# EAGLE design PulseGenerator (EAGLE 9.6.2)
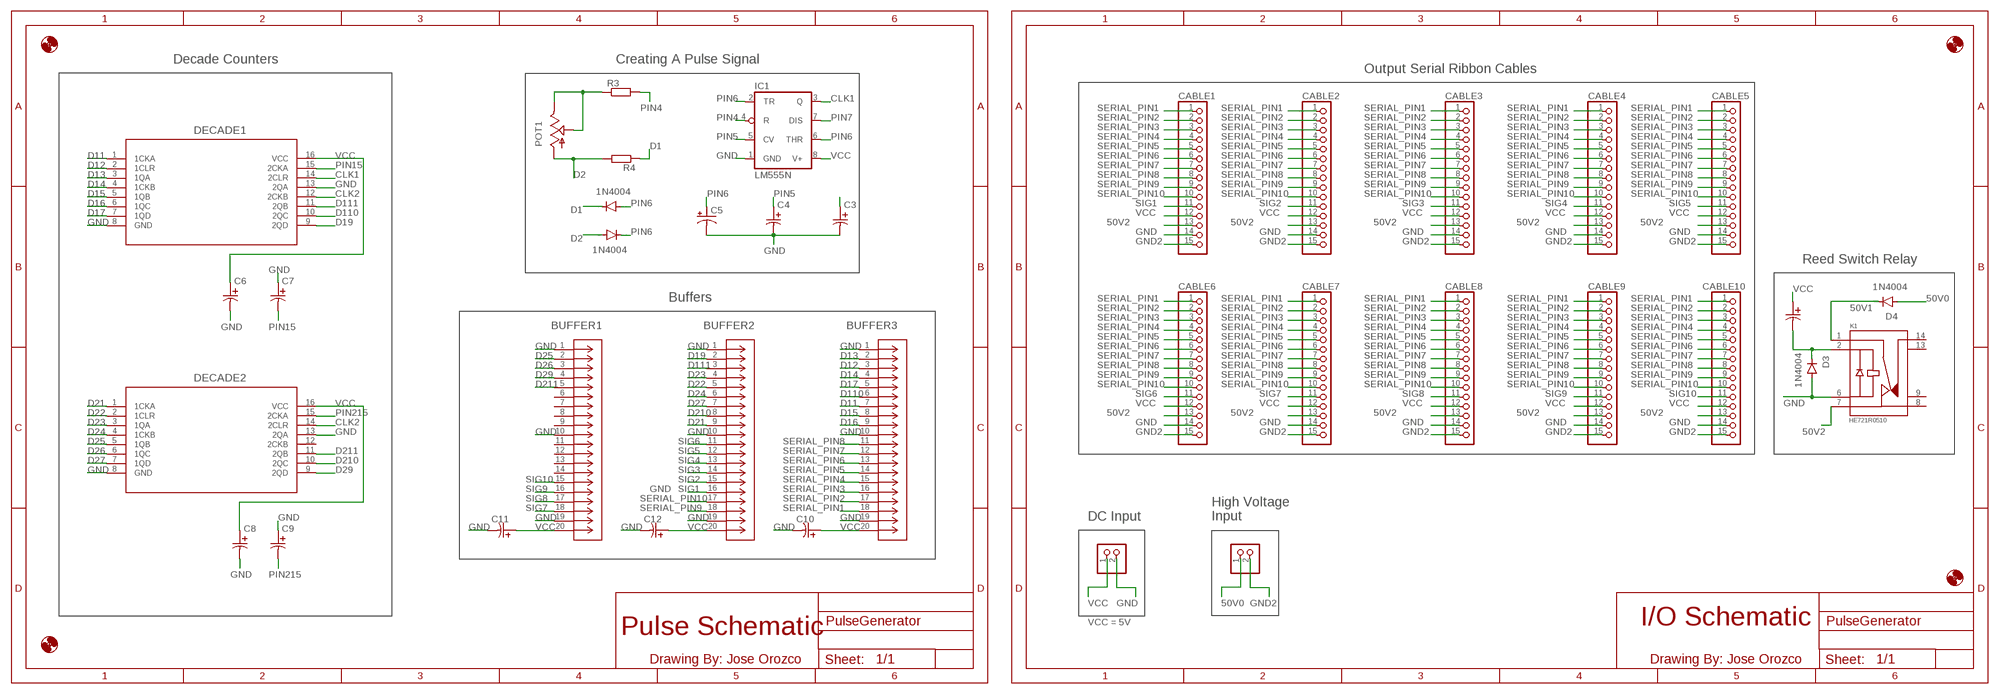
[diagram p0: schematic, sheet 1]

## Parts
BUFFER1  4820-3000-CP  [CONN_3000_3MM]
BUFFER2  4820-3000-CP  [CONN_3000_3MM]
BUFFER3  4820-3000-CP  [CONN_3000_3MM]
C1  C322C104K5R5TA  [CAP_C322_KEM]
C3  C322C104K5R5TA  [CAP_C322_KEM]
C4  C322C104K5R5TA  [CAP_C322_KEM]
C5  CPOL-USTAP5-45  [TAP5-45]
C6  C322C104K5R5TA  [CAP_C322_KEM]
C7  C322C104K5R5TA  [CAP_C322_KEM]
C8  C322C104K5R5TA  [CAP_C322_KEM]
C9  C322C104K5R5TA  [CAP_C322_KEM]
C10  C322C104K5R5TA  [CAP_C322_KEM]
C11  C322C104K5R5TA  [CAP_C322_KEM]
C12  C322C104K5R5TA  [CAP_C322_KEM]
CABLE1  PINHD-1X15  [1X15]
CABLE2  PINHD-1X15  [1X15]
CABLE3  PINHD-1X15  [1X15]
CABLE4  PINHD-1X15  [1X15]
CABLE5  PINHD-1X15  [1X15]
CABLE6  PINHD-1X15  [1X15]
CABLE7  PINHD-1X15  [1X15]
CABLE8  PINHD-1X15  [1X15]
CABLE9  PINHD-1X15  [1X15]
CABLE10  PINHD-1X15  [1X15]
D1  1N4004  [DO41-10]
D2  1N4004  [DO41-10]
D3  1N4004  [DO41-10]
D4  1N4004  [DO41-10]
DECADE1  SN74LS390N  [N16]
DECADE2  SN74LS390N  [N16]
H1  MOUNT-HOLE2.8  [2,8]
H2  MOUNT-HOLE2.8  [2,8]
H3  MOUNT-HOLE2.8  [2,8]
H4  MOUNT-HOLE2.8  [2,8]
IC1  LM555N  [DIL08]
JP1  PINHD-1X2  [1X02]
JP2  PINHD-1X2  [1X02]
K1  HE721R0510  [RELAY_HE721R0510]
POT1  TRIM_US-S63X  [S63X]
R3  R-EU_0309/10  [0309/10]
R4  R-EU_0309/10  [0309/10]

## Nets
50V0: D4.A JP2.1
50V1: D4.C K1.1
50V2: CABLE1.13 CABLE2.13 CABLE3.13 CABLE4.13 CABLE5.13 CABLE6.13 CABLE7.13 CABLE8.13 CABLE9.13 CABLE10.13 K1.7
CLK1: DECADE1.14(2CLR) IC1.3(Q)
CLK2: DECADE1.12(2CKB) DECADE2.14(2CLR)
D1: D1.C R4.1
D2: D2.A POT1.A R4.2
D11: BUFFER3.7 DECADE1.1(1CKA)
D12: BUFFER3.3 DECADE1.2(1CLR)
D13: BUFFER3.2 DECADE1.3(1QA)
D14: BUFFER3.4 DECADE1.4(1CKB)
D15: BUFFER3.8 DECADE1.5(1QB)
D16: BUFFER3.9 DECADE1.6(1QC)
D17: BUFFER3.5 DECADE1.7(1QD)
D19: BUFFER2.2 DECADE1.9(2QD)
D21: BUFFER2.9 DECADE2.1(1CKA)
D22: BUFFER2.5 DECADE2.2(1CLR)
D23: BUFFER2.4 DECADE2.3(1QA)
D24: BUFFER2.6 DECADE2.4(1CKB)
D25: BUFFER1.2 DECADE2.5(1QB)
D26: BUFFER1.3 DECADE2.6(1QC)
D27: BUFFER2.7 DECADE2.7(1QD)
D29: BUFFER1.4 DECADE2.9(2QD)
D110: BUFFER3.6 DECADE1.10(2QC)
D111: BUFFER2.3 DECADE1.11(2QB)
D210: BUFFER2.8 DECADE2.10(2QC)
D211: BUFFER1.5 DECADE2.11(2QB)
GND: BUFFER1.1 BUFFER1.10 BUFFER1.19 BUFFER2.1 BUFFER2.10 BUFFER2.19 BUFFER3.1 BUFFER3.10 BUFFER3.19 C3.2 C4.2 C5.- C6.2 C7.1 C8.2 C9.1 C10.2 C11.2 C12.2 CABLE1.14 CABLE2.14 CABLE3.14 CABLE4.14 CABLE5.14 CABLE6.14 CABLE7.14 CABLE8.14 CABLE9.14 CABLE10.14 D3.A DECADE1.8(GND) DECADE1.13(2QA) DECADE2.8(GND) DECADE2.13(2QA) IC1.1(GND) JP1.2 K1.6
GND2: CABLE1.15 CABLE2.15 CABLE3.15 CABLE4.15 CABLE5.15 CABLE6.15 CABLE7.15 CABLE8.15 CABLE9.15 CABLE10.15 JP2.2
N$1: POT1.E POT1.S R3.1
N$4: C1.2 D3.C K1.2
N$5: C3.1
PIN4: IC1.4(R) R3.2
PIN5: C4.1 IC1.5(CV)
PIN6: C5.+ D1.A D2.C IC1.2(TR) IC1.6(THR)
PIN7: IC1.7(DIS)
PIN15: C7.2 DECADE1.15(2CKA)
PIN215: C9.2 DECADE2.15(2CKA)
SERIAL_PIN1: BUFFER3.18 CABLE1.1 CABLE2.1 CABLE3.1 CABLE4.1 CABLE5.1 CABLE6.1 CABLE7.1 CABLE8.1 CABLE9.1 CABLE10.1
SERIAL_PIN2: BUFFER3.17 CABLE1.2 CABLE2.2 CABLE3.2 CABLE4.2 CABLE5.2 CABLE6.2 CABLE7.2 CABLE8.2 CABLE9.2 CABLE10.2
SERIAL_PIN3: BUFFER3.16 CABLE1.3 CABLE2.3 CABLE3.3 CABLE4.3 CABLE5.3 CABLE6.3 CABLE7.3 CABLE8.3 CABLE9.3 CABLE10.3
SERIAL_PIN4: BUFFER3.15 CABLE1.4 CABLE2.4 CABLE3.4 CABLE4.4 CABLE5.4 CABLE6.4 CABLE7.4 CABLE8.4 CABLE9.4 CABLE10.4
SERIAL_PIN5: BUFFER3.14 CABLE1.5 CABLE2.5 CABLE3.5 CABLE4.5 CABLE5.5 CABLE6.5 CABLE7.5 CABLE8.5 CABLE9.5 CABLE10.5
SERIAL_PIN6: BUFFER3.13 CABLE1.6 CABLE2.6 CABLE3.6 CABLE4.6 CABLE5.6 CABLE6.6 CABLE7.6 CABLE8.6 CABLE9.6 CABLE10.6
SERIAL_PIN7: BUFFER3.12 CABLE1.7 CABLE2.7 CABLE3.7 CABLE4.7 CABLE5.7 CABLE6.7 CABLE7.7 CABLE8.7 CABLE9.7 CABLE10.7
SERIAL_PIN8: BUFFER3.11 CABLE1.8 CABLE2.8 CABLE3.8 CABLE4.8 CABLE5.8 CABLE6.8 CABLE7.8 CABLE8.8 CABLE9.8 CABLE10.8
SERIAL_PIN9: BUFFER2.18 CABLE1.9 CABLE2.9 CABLE3.9 CABLE4.9 CABLE5.9 CABLE6.9 CABLE7.9 CABLE8.9 CABLE9.9 CABLE10.9
SERIAL_PIN10: BUFFER2.17 CABLE1.10 CABLE2.10 CABLE3.10 CABLE4.10 CABLE5.10 CABLE6.10 CABLE7.10 CABLE8.10 CABLE9.10 CABLE10.10
SIG1: BUFFER2.16 CABLE1.11
SIG2: BUFFER2.15 CABLE2.11
SIG3: BUFFER2.14 CABLE3.11
SIG4: BUFFER2.13 CABLE4.11
SIG5: BUFFER2.12 CABLE5.11
SIG6: BUFFER2.11 CABLE6.11
SIG7: BUFFER1.18 CABLE7.11
SIG8: BUFFER1.17 CABLE8.11
SIG9: BUFFER1.16 CABLE9.11
SIG10: BUFFER1.15 CABLE10.11
VCC: BUFFER1.20 BUFFER2.20 BUFFER3.20 C1.1 C6.1 C8.1 C10.1 C11.1 C12.1 CABLE1.12 CABLE2.12 CABLE3.12 CABLE4.12 CABLE5.12 CABLE6.12 CABLE7.12 CABLE8.12 CABLE9.12 CABLE10.12 DECADE1.16(VCC) DECADE2.16(VCC) IC1.8(V+) JP1.1
Unconnected: BUFFER1.6 BUFFER1.7 BUFFER1.8 BUFFER1.9 BUFFER1.11 BUFFER1.12 BUFFER1.13 BUFFER1.14 DECADE2.12(2CKB) K1.8 K1.9 K1.13 K1.14

## Notes on the sheet
- Decade Counters | Creating A Pulse Signal
- Output Serial Ribbon Cables
- Reed Switch Relay
- Buffers
- DC Input
- High Voltage
  Input
- VCC = 5V | I/O Schematic
- Pulse Schematic
- Drawing By: Jose Orozco | Drawing By: Jose Orozco

## Library data of the parts
BUFFER1-BUFFER3 = socket20pin:4820-3000-CP; BUILT_BY: EMA_Matt; COPYRIGHT: Copyright (C) 2018 Accelerated Designs. All rights reserved; MANUFACTURER_PART_NUMBER: 4820-3000-CP; SOURCELIBRARY: 3M_2019-10-11; VENDOR: 3M
C1 C3 C4 C6-C12 = cap104:C322C104K5R5TA; BUILT_BY: EMA_UL_Team; MANUFACTURER_PART_NUMBER: C322C104K5R5TA; SOURCELIBRARY: Kemet_2012-08-08; VENDOR: Kemet
C5 = rcl:CPOL-US: POLARIZED CAPACITOR, American symbol; SPICEPREFIX: C
CABLE1-CABLE10 = pinhead:PINHD-1X15: PIN HEADER
D1-D4 = diode:1N4004: DIODE general purpose rectifier, 1 A
DECADE1 DECADE2 = DecadeCounter:SN74LS390N; DATASHEET_URL: http://www.ti.com/lit/gpn/SN74LS390; DESCRIPTION: Dual 4-Bit Decade Counters; FAMILY_NAME: DECADE COUNTER; GENERIC_PART_NUMBER: SN74LS390; INDUSTRY_STD_PKG_TYPE: PDIP; MANUFACTURER: Texas Instruments; PACKAGE_DESIGNATOR: N; PIN_COUNT: 16
H1-H4 = holes:MOUNT-HOLE: MOUNTING HOLE with drill center marker
IC1 = linear:*555: TIMER
JP1 JP2 = pinhead:PINHD-1X2: PIN HEADER
K1 = HE721R0510:HE721R0510: HE700 Series Dual in Line 0.25 A SPDT 5 VDC PCB Mount Reed Relay; DESCRIPTION: RELAY REED SPDT 250MA 5V; DIGI-KEY_PART_NUMBER: F11467-ND; MF: Littelfuse Inc.; MP: HE721R0510; PACKAGE: None; PURCHASE-URL: https://pricing.snapeda.com/search/part/HE721R0510/?ref=eda
POT1 = pot:TRIM_US-: POTENTIOMETER
R3 R4 = rcl:R-EU_: RESISTOR, European symbol; SPICEPREFIX: R

## Board
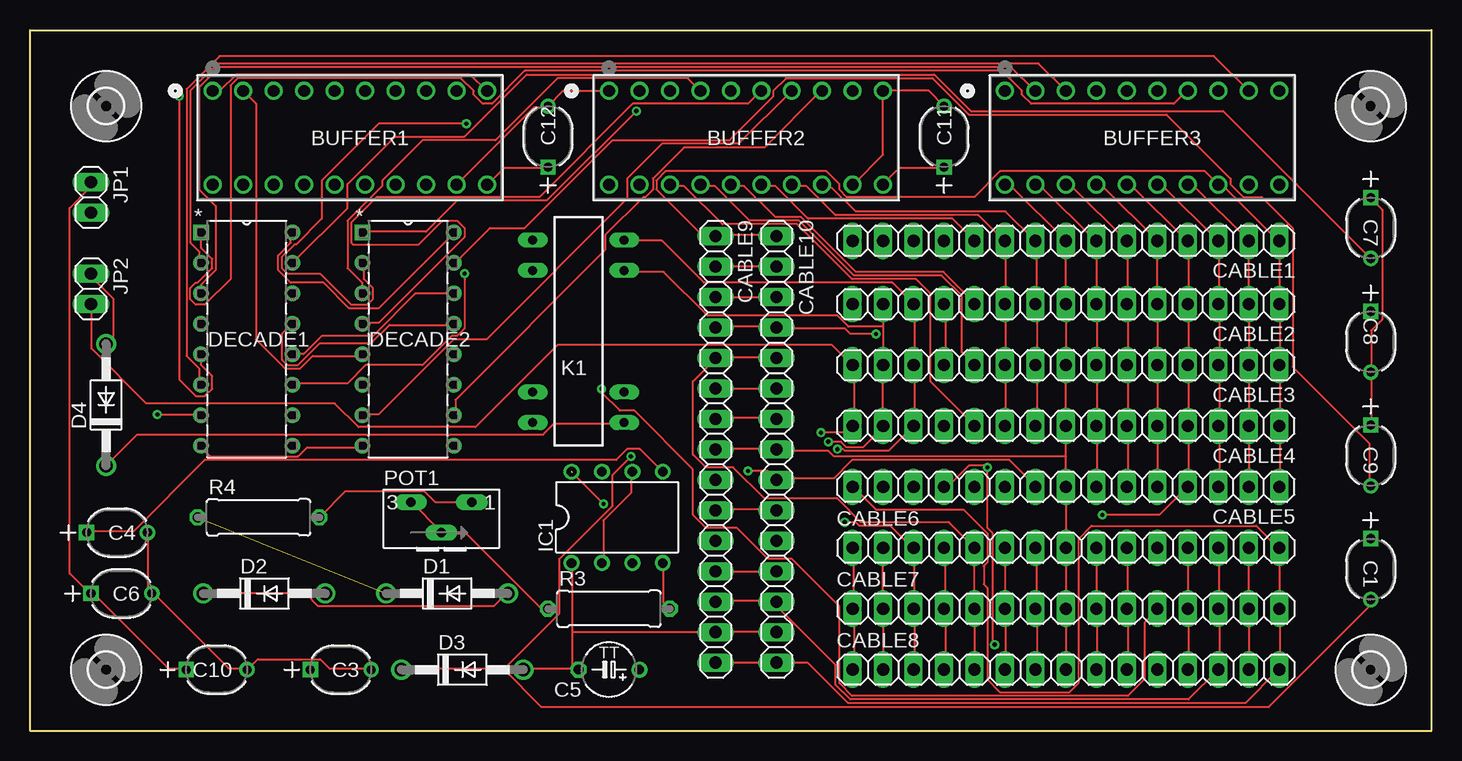
[diagram p1: board, top side]
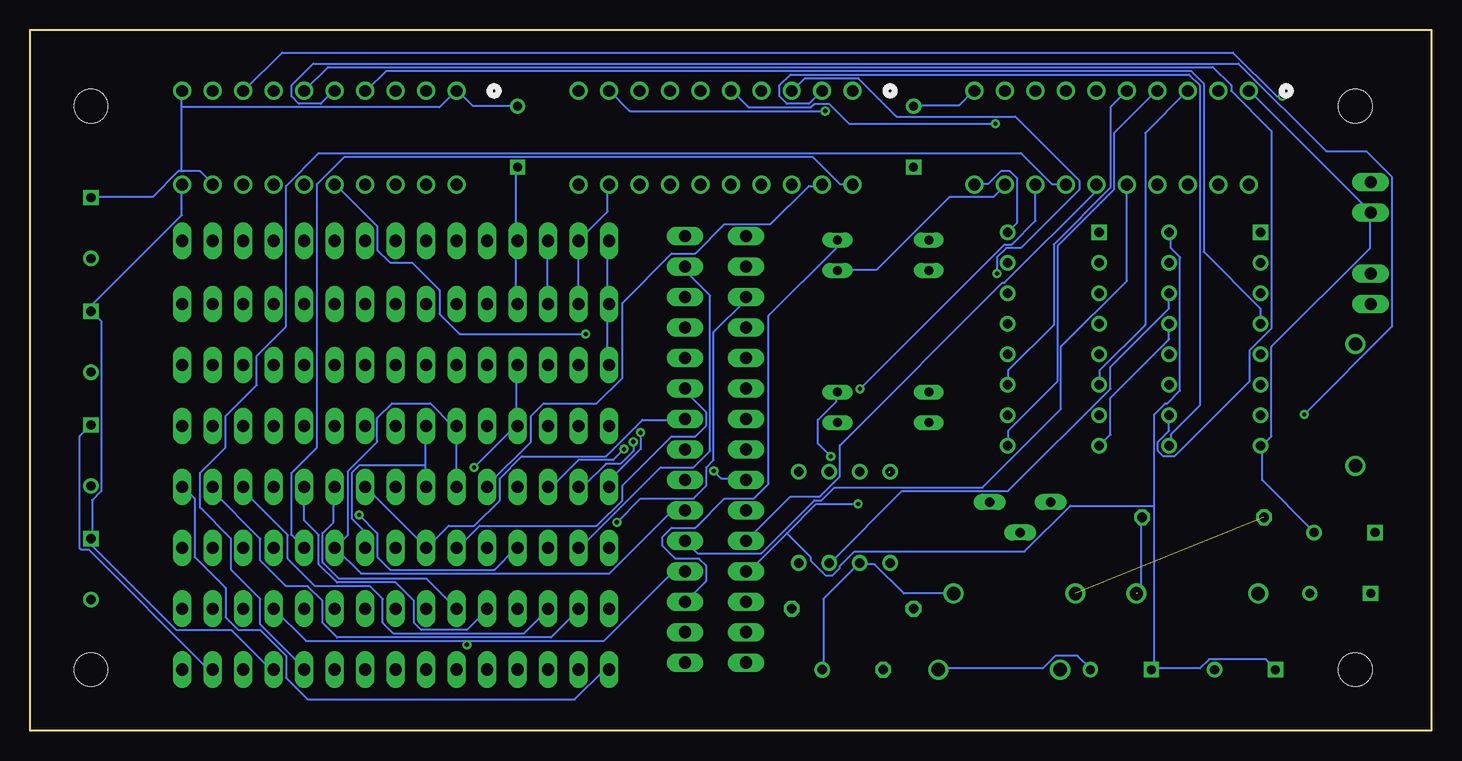
[diagram p2: board, bottom side, seen from below]

Size 116.84 x 58.42 mm. Coordinates in mm from the lower left corner, seen from the top.
Outline: 0,0 116.84,0 116.84,58.42 0,58.42 0,0
Copper layers (1*16): Top 0.035mm / dielectric 1.5mm / Bottom 0.035mm
Design rules "default": minimum track width 6mil, minimum drill 0.35mm, track to track 6mil, track to pad 6mil, pad to pad 6mil, via to via 6mil, smd to smd 6mil, copper to edge 40mil, drill to drill 6mil, minimum pad ring 10mil, minimum via ring 8mil, stop-mask expansion 4mil, vias tented up to drill 0mil, thermal gap 10mil

### Footprints (pad centres in the part's own frame; a part is rotated, then mirrored left to right if it is on the bottom)
CONN_3000_3MM = drill 0.991 pad 1.499: 1 0,0; 2 2.54,0; 3 5.08,0; 4 7.62,0; 5 10.16,0; 6 12.7,0; 7 15.24,0; 8 17.78,0; 9 20.32,0; 10 22.86,0; 11 0,-7.823; 12 2.54,-7.823; 13 5.08,-7.823; 14 7.62,-7.823; 15 10.16,-7.823; 16 12.7,-7.823; 17 15.24,-7.823; 18 17.78,-7.823; 19 20.32,-7.823; 20 22.86,-7.823
CAP_C322_KEM = drill 0.762 pad 1.27 square: 1 0,0 | drill 0.762 pad 1.27: 2 5.08,0
TAP5-45 = drill 0.813: + -2.54,0 | drill 0.813 octagon: - 2.54,0
1X15 = drill 1.016 long: 1 -17.78,0; 2 -15.24,0; 3 -12.7,0; 4 -10.16,0; 5 -7.62,0; 6 -5.08,0; 7 -2.54,0; 8 0,0; 9 2.54,0; 10 5.08,0; 11 7.62,0; 12 10.16,0; 13 12.7,0; 14 15.24,0; 15 17.78,0
DO41-10 = drill 1.118: A 5.08,0; C -5.08,0
N16 = drill 0.787 pad 1.295 square: 1 -7.62,17.78 | drill 0.787 pad 1.295: 2 -7.62,15.24; 3 -7.62,12.7; 4 -7.62,10.16; 5 -7.62,7.62; 6 -7.62,5.08; 7 -7.62,2.54; 8 -7.62,0; 9 0,0; 10 0,2.54; 11 0,5.08; 12 0,7.62; 13 0,10.16; 14 0,12.7; 15 0,15.24; 16 0,17.78
2,8 = hole 2.8: 0,0
DIL08 = drill 0.813 pad 1.27: 1 -3.81,-3.81; 2 -1.27,-3.81; 3 1.27,-3.81; 4 3.81,-3.81; 5 3.81,3.81; 6 1.27,3.81; 7 -1.27,3.81; 8 -3.81,3.81
1X02 = drill 1.016 long: 1 -1.27,0; 2 1.27,0
RELAY_HE721R0510 = drill 0.75 long: 1 -3.81,7.62; 2 -3.81,5.08; 6 -3.81,-5.08; 7 -3.81,-7.62; 8 3.81,-7.62; 9 3.81,-5.08; 13 3.81,5.08; 14 3.81,7.62
S63X = drill 0.813 long: A 2.54,0; E -2.54,0; S 0,-2.54
0309/10 = drill 0.813 octagon: 1 -5.08,0; 2 5.08,0

### Placement (x,y rotation side)
BUFFER1  15.24,53.34 0 top
BUFFER2  48.26,53.34 0 top
BUFFER3  81.28,53.34 0 top
C1  111.76,16 270 top
C3  23.37,5.08 0 top
C4  4.72,16.51 0 top
C5  48.26,5.08 180 top
C6  5.08,11.43 0 top
C7  111.76,44.45 270 top
C8  111.76,34.97 270 top
C9  111.76,25.48 270 top
C10  13.01,5.08 0 top
C11  76.2,46.99 90 top
C12  43.18,46.99 90 top
CABLE1  86.36,40.84 180 top
CABLE2  86.36,35.56 180 top
CABLE3  86.36,30.48 180 top
CABLE4  86.36,25.4 180 top
CABLE5  86.36,20.32 180 top
CABLE6  86.36,15.24 0 top
CABLE7  86.36,10.16 0 top
CABLE8  86.36,5.08 0 top
CABLE9  57.15,23.44 270 top
CABLE10  62.23,23.44 270 top
D1  34.77,11.43 0 top
D2  19.53,11.43 0 top
D3  36.04,5.08 0 top
D4  6.35,27.15 90 top
DECADE1  21.88,23.75 0 top
DECADE2  35.32,23.75 0 top
H1  6.35,5.08 0 top
H2  111.76,5.08 0 top
H3  111.76,52.07 0 top
H4  6.35,52.07 0 top
IC1  48.95,17.78 0 top
JP1  5.08,44.45 270 top
JP2  5.08,36.83 270 top
K1  45.72,33.29 180 top
POT1  34.29,19.05 0 top
R3  48.26,10.16 0 top
R4  19.05,17.78 0 top

### Tracks (layer width: path | path; a pad name or v marks a point on that pad's centre or on a via)
50V0
  Top 0.152: JP2.1 5.13,38.1 5.13,37.79 6.96,35.97 6.96,32.92 6.35,32.31 D4.A
50V1
  Top 0.152: K1.1 49.48,25.6 43.69,25.6 42.77,24.69 8.94,24.69 6.35,22.1 D4.C
50V2  (via drill 0.35)
  Top 0.152: v67.31,23.47 67.77,23.47 67.92,23.32 71.58,23.32 CABLE4.13 73.71,25.45 73.71,30.48 | K1.7 49.63,40.84 52.68,40.84 56.18,37.34 71.88,37.34 CABLE2.13 73.71,35.51 73.71,30.48 | 73.71,30.48 CABLE3.13 | CABLE9.13 57.25,10.82 62.13,10.82 CABLE10.13 62.28,10.67 62.28,10.36 67.16,5.49 67.16,3.81 68.38,2.59 96.57,2.59 CABLE8.13 99.16,5.18 99.16,10.06 CABLE7.13 99.16,10.21 99.16,15.24 CABLE6.13
  Bottom 0.152: v67.31,23.47 68.22,22.55 71.12,22.55 73.25,20.42 73.56,20.42 CABLE5.13 | CABLE1.13 73.71,40.84 73.71,35.66 CABLE2.13 | K1.7 49.63,40.84 49.63,40.23 55.27,34.6 55.27,20.57 56.49,19.36 58.93,19.36 61.37,16.92 63.35,16.92 64.11,16.15 64.11,15.39 63.04,14.33 61.06,14.33 60.45,13.72 60.45,12.5 62.13,10.82 CABLE10.13
CLK1
  Bottom 0.152: DECADE1.14 21.89,36.42 21.89,35.2 26.77,30.33 26.77,28.5 35.31,19.96 44.14,19.96 50.09,14.02 IC1.3
CLK2
  Top 0.152: DECADE1.12 21.89,31.39 22.81,31.39 24.33,32.92 28.6,32.92 32.11,36.42 35.31,36.42 DECADE2.14
D1  (1 unrouted)
D2  (1 unrouted)
  Top 0.152: POT1.A 33.78,19.05 32.87,19.96 26.31,19.96 R4.2
  Bottom 0.152: 24.49,11.43 24.18,11.73 24.18,17.68 R4.2
D11
  Top 0.152: DECADE1.1 14.28,41.45 14.28,40.23 15.19,39.32 15.19,38.56 13.97,37.34 13.82,37.34 13.36,36.88 13.36,35.97 13.82,35.51 14.58,35.51 16.71,37.64 16.71,53.8 17.32,54.41 35.92,54.41 36.98,53.34 36.98,53.04 37.74,52.27 38.51,52.27 41.25,55.02 81.03,55.02 82.7,53.34 82.7,53.04 83.46,52.27 95.35,52.27 96.42,53.34 BUFFER3.7
D12
  Top 0.152: BUFFER3.3 84.07,55.63 15.65,55.63 13.36,53.34 13.36,40.69 14.12,39.93 14.12,39.01 DECADE1.2
D13
  Top 0.152: DECADE1.3 14.28,36.58 14.28,37.19 15.49,38.4 15.49,43.74 14.12,45.11 14.12,53.65 15.8,55.32 81.79,55.32 83.77,53.34 BUFFER3.2
D14
  Bottom 0.152: DECADE1.4 14.28,33.99 14.28,35.2 19,39.93 19,53.95 20.07,55.02 87.12,55.02 88.8,53.34 BUFFER3.4
D15  (via drill 0.35)
  Top 0.152: v12.45,52.88 12.45,29.26 13.82,27.89 14.58,27.89 15.19,28.5 15.19,29.57 14.28,30.48 14.28,31.24 DECADE1.5
  Bottom 0.152: v12.45,52.88 12.9,52.88 16.56,56.54 95.81,56.54 99.01,53.34 BUFFER3.8
D16
  Top 0.152: BUFFER3.9 98.7,56.24 15.8,56.24 13.06,53.49 13.06,31.24 14.12,30.18 14.12,28.96 DECADE1.6
D17  (via drill 0.35)
  Top 0.152: v10.62,26.37 14.12,26.37 DECADE1.7
  Bottom 0.152: v10.62,26.37 3.3,33.68 3.3,46.18 5.44,48.31 8.79,48.31 16.1,55.63 93.22,55.63 95.05,53.8 95.05,52.88 94.44,52.27 92.61,52.27 91.54,53.34 BUFFER3.5
D19
  Bottom 0.152: DECADE1.9 21.74,23.77 21.74,24.69 19.3,27.13 19.3,53.8 20.22,54.71 53.44,54.71 54.36,53.8 54.36,52.88 53.75,52.27 51.92,52.27 50.85,53.34 BUFFER2.2
D21  (via drill 0.35)
  Top 0.152: v50.55,51.66 43.08,44.2 35.61,44.2 33.02,41.6 27.84,41.6 DECADE2.1
  Bottom 0.152: v50.55,51.66 66.85,51.66 68.53,53.34 BUFFER2.9
D22  (via drill 0.35)
  Top 0.152: v36.37,50.6 29.06,50.6 24.33,45.87 24.33,42.67 22.2,40.54 22.05,40.54 20.98,39.47 20.98,38.56 21.44,38.1 24.18,38.1 26.77,35.51 28.14,35.51 28.6,35.97 28.6,36.88 27.84,37.64 27.84,38.86 DECADE2.2
  Bottom 0.152: v36.37,50.6 48.56,50.6 50.24,52.27 51.46,52.27 51.76,51.97 56.95,51.97 58.32,53.34 BUFFER2.5
D23
  Top 0.152: BUFFER2.4 54.81,54.41 43.99,54.41 38.81,49.23 32.71,49.23 29.36,45.87 29.36,45.41 26.47,42.52 26.47,38.56 27.69,37.34 27.69,36.58 DECADE2.3
D24
  Top 0.152: DECADE2.4 27.84,33.99 29.06,33.99 36.22,41.15 36.22,41.91 35.61,42.52 34.39,42.52 32.41,40.54 26.92,40.54 26.77,40.69 26.77,42.37 28.91,44.5 42.47,44.5 50.24,52.27 59.84,52.27 60.91,53.34 BUFFER2.6
D25
  Top 0.152: BUFFER1.2 18.85,52.27 18.85,32.61 21.29,30.18 22.5,30.18 23.57,31.24 27.69,31.24 DECADE2.5
D26
  Bottom 0.152: DECADE2.6 27.69,28.96 27.69,30.02 23.88,33.83 23.88,49.84 20.37,53.34 BUFFER1.3
D27
  Top 0.152: BUFFER2.7 59.08,48.92 52.68,48.92 49.78,46.02 49.78,44.35 38.05,32.61 35.31,32.61 29.06,26.37 27.84,26.37 DECADE2.7
D29
  Bottom 0.152: DECADE2.9 35.31,23.77 35.31,24.99 31.19,29.11 31.19,40.39 26.47,45.11 26.47,49.84 22.96,53.34 BUFFER1.4
D110
  Bottom 0.152: BUFFER3.6 92,55.32 18.24,55.32 16.71,53.8 16.71,53.34 13.36,49.99 13.36,33.53 15.19,31.7 15.19,29.11 21.44,22.86 22.35,22.86 22.81,23.32 22.81,24.08 21.89,24.99 21.89,26.21 DECADE1.10
D111  (via drill 0.35)
  Top 0.152: v36.22,38.1 36.22,33.53 35.61,32.92 35.15,32.92 32.71,30.48 27.99,30.48 26.47,28.96 21.89,28.96 DECADE1.11
  Bottom 0.152: v36.22,38.1 36.22,39.47 35.46,40.23 34.24,40.23 29.36,45.11 29.36,45.87 34.7,51.21 44.6,51.21 47.8,54.41 52.22,54.41 53.29,53.34 BUFFER2.3
D210
  Top 0.152: DECADE2.10 35.46,26.37 35.46,27.58 47.95,40.08 47.95,41.3 51.16,44.5 51.31,44.5 51.92,45.11 51.92,46.02 54.51,48.62 61.21,48.62 65.94,53.34 BUFFER2.8
D211
  Bottom 0.152: BUFFER1.5 26.77,51.97 26.77,45.26 31.5,40.54 31.5,33.83 35.31,30.02 35.31,28.96 DECADE2.11
GND  (via drill 0.35)
  Top 0.152: CABLE10.14 62.13,8.23 57.25,8.23 CABLE9.14 57.1,8.23 45.21,8.23 | 45.21,5.18 41.25,5.18 D3.A | 45.21,5.18 45.67,5.18 C5.- 45.21,5.18 | 45.21,5.18 45.21,8.23 | 45.21,8.23 45.21,13.87 IC1.1 | DECADE2.13 35.31,33.83 29.97,33.83 28.45,32.31 24.18,32.31 22.35,30.48 21.44,30.48 20.98,30.94 20.98,33.07 21.74,33.83 DECADE1.13 | C6.2 9.86,11.73 9.86,16.46 C4.2 | C6.2 | C6.2 10.31,11.43 16.56,5.18 18.09,5.18 C10.2 18.24,5.18 19,5.94 24.18,5.94 24.94,5.18 28.45,5.18 C3.2 | DECADE2.8 27.69,23.62 23.11,23.62 22.35,22.86 15.04,22.86 14.28,23.62 DECADE1.8 | CABLE8.14 CABLE7.14 CABLE6.14 | C9.1 111.81,25.6 111.81,29.87 C8.2 111.81,30.02 111.81,33.38 112.73,34.29 112.73,43.43 111.81,44.35 C7.1 | BUFFER2.1 44.45,53.34 C12.2 43.08,51.97 42.01,51.97 BUFFER1.19 | C11.2 74.93,53.34 BUFFER2.10 71.12,48.01 68.68,45.57 BUFFER2.19 | CABLE2.14 71.12,33.68 | 71.12,33.68 CABLE3.14 CABLE4.14 71.12,25.3 69.44,23.62 68.07,23.62 67.62,24.08 v66.55,24.08 | 71.12,33.68 68.22,33.68 67.31,34.6 56.49,34.6 52.83,38.25 49.63,38.25 K1.6 | BUFFER1.1 15.8,53.34 17.17,54.71 36.68,54.71 38.05,53.34 BUFFER1.10
  Bottom 0.152: DECADE1.13 21.89,33.83 21.89,32.61 26.77,27.74 26.77,24.69 27.69,23.77 DECADE2.8 | BUFFER1.1 15.19,53.34 5.13,43.28 JP1.2 5.13,43.13 5.13,40.23 13.36,32 13.36,24.54 14.12,23.77 DECADE1.8 14.12,23.62 14.12,20.88 9.86,16.61 C4.2 | D3.A 41.1,5.18 32.41,5.18 31.34,6.25 29.52,6.25 28.45,5.18 C3.2 | 104.19,46.63 102.67,46.63 101.6,45.57 BUFFER3.19 | 104.19,46.63 104.5,46.63 106.63,44.5 111.66,44.5 C7.1 | 104.19,46.63 104.19,51.97 | 104.19,51.97 104.19,53.34 BUFFER3.10 | CABLE8.14 101.6,5.18 102.06,5.18 111.96,15.09 112.57,15.09 112.73,15.24 112.73,24.54 111.81,25.45 C9.1 | C12.2 43.08,52.12 39.42,52.12 38.2,53.34 BUFFER1.10 | K1.6 49.48,38.4 46.28,38.4 40.18,44.5 36.52,44.5 35.61,45.41 BUFFER1.19 | C11.2 76.3,52.12 79.96,52.12 81.18,53.34 BUFFER3.1 81.33,53.34 82.7,51.97 104.19,51.97 | BUFFER2.19 68.68,45.41 68.68,43.28 CABLE1.14 CABLE2.14 | v66.55,24.08 66.55,23.32 67.62,22.25 68.83,22.25 70.66,20.42 71.12,20.42 CABLE5.14
GND2  (via drill 0.35)
  Top 0.152: CABLE9.15 57.25,5.64 62.13,5.64 CABLE10.15 62.28,5.64 64.87,5.64 68.22,2.29 101.3,2.29 104.04,5.03 CABLE8.15 104.19,5.18 104.19,10.06 CABLE7.15 104.19,10.21 104.19,15.24 CABLE6.15 104.04,15.24 102.21,17.07 88.49,17.07 87.43,16 87.43,3.96 86.67,3.2 80.87,3.2 79.81,4.27 79.81,11.89 79.5,12.19 79.5,13.72 79.81,14.02 79.81,16.46 77.83,18.44 70.51,18.44 68.68,20.27 CABLE5.15 | v65.94,24.84 68.07,24.84 68.53,25.3 CABLE4.15 68.68,25.45 68.68,30.48 CABLE3.15 68.53,30.48 66.85,32.16 43.99,32.16 37.13,25.3 27.38,25.3 25.4,27.28 9.7,27.28 5.13,31.85 5.13,35.51 JP2.2
  Bottom 0.152: v65.94,24.84 65.94,23.47 68.53,20.88 68.53,20.42 CABLE5.15 | CABLE3.15 68.68,30.48 68.68,35.51 CABLE2.15 68.68,35.66 68.68,40.84 CABLE1.15
N$1
  Top 0.152: POT1.E 31.8,19.05 34.24,16.61 POT1.S 34.39,16.46 36.37,16.46 42.62,10.21 43.08,10.21 R3.1
N$4  (via drill 0.35)
  Top 0.152: v50.09,22.86 48.56,21.34 48.56,18.74 44.14,14.33 44.14,9.75 39.57,5.18 39.42,5.18 | 39.42,5.18 31.04,5.18 D3.C | 39.42,5.18 42.62,1.98 103.28,1.98 111.66,10.36 111.66,10.82 C1.2
  Bottom 0.152: v50.09,22.86 51.16,23.93 51.16,25.91 49.63,27.43 49.63,28.19 K1.2
PIN4
  Top 0.152: R3.2 52.83,10.67 52.83,13.87 IC1.4
PIN5
  Top 0.152: C4.1 4.83,16.61 8.64,16.61 14.58,22.55 48.87,22.55 49.78,23.47 50.85,23.47 52.68,21.64 IC1.5
PIN6
  Top 0.152: IC1.2 47.8,14.02 47.8,17.53 50.09,19.81 50.09,21.49 IC1.6 | D2.C 22.96,11.43 24.03,10.36 38.66,10.36 39.73,11.43 D1.A
  Bottom 0.152: C5.+ 50.7,5.18 50.7,10.97 47.8,13.87 IC1.2 47.65,13.87 46.43,13.87 43.99,11.43 D1.A
PIN15
  Top 0.152: C7.2 111.66,39.47 99.47,51.66 78.44,51.66 75.39,54.71 41.4,54.71 36.22,49.53 30.43,49.53 26.47,45.57 26.47,43.59 21.89,39.01 DECADE1.15
PIN215
  Top 0.152: C9.2 111.66,20.42 111.66,23.93 105.26,30.33 105.26,41.91 102.67,44.5 101.14,44.5 100.08,45.57 100.08,46.02 94.74,51.36 78.28,51.36 75.23,54.41 63.04,54.41 61.98,53.34 61.98,52.88 58.32,49.23 48.56,49.23 41.25,41.91 38.35,41.91 35.46,39.01 DECADE2.15
SERIAL_PIN1
  Top 0.152: CABLE10.1 62.13,41.3 57.25,41.3 CABLE9.1 57.1,41.3 56.03,41.3 52.22,45.11 52.22,45.87 52.98,46.63 66.4,46.63 67.46,45.57 67.46,45.11 68.07,44.5 78.74,44.5 80.87,46.63 97.94,46.63 BUFFER3.18 99.16,45.41 99.47,45.41 104.04,40.84 CABLE1.1 104.19,40.84 104.19,35.66 CABLE2.1 104.19,35.51 104.19,30.48 | CABLE8.1 68.68,5.18 68.68,10.06 CABLE7.1 68.68,10.21 68.68,15.24 CABLE6.1 | CABLE5.1 104.19,20.42 104.19,25.3 CABLE4.1 104.19,25.45 104.19,30.48 | 104.19,30.48 CABLE3.1
  Bottom 0.152: CABLE8.1 68.68,5.03 68.99,5.03 71.42,2.59 93.67,2.59 95.5,4.42 95.5,6.25 97.64,8.38 99.47,8.38 100.53,9.45 100.53,11.89 103.12,14.48 103.12,19.36 104.04,20.27 CABLE5.1
SERIAL_PIN2
  Top 0.152: BUFFER3.17 96.57,45.41 97.03,45.41 CABLE1.2 CABLE2.2 CABLE3.2 CABLE4.2 CABLE5.2 | CABLE9.2 57.25,38.71 62.13,38.71 CABLE10.2 | CABLE8.2 CABLE7.2 CABLE6.2
  Bottom 0.152: CABLE6.2 70.97,15.24 64.26,21.95 61.52,21.95 60.15,23.32 60.15,36.27 62.13,38.25 62.13,38.56 CABLE10.2 | CABLE5.2 101.6,19.96 97.64,16 97.64,14.17 95.5,12.04 93.67,12.04 92.46,10.82 92.46,8.99 91.24,7.77 73.41,7.77 71.12,10.06 CABLE7.2
SERIAL_PIN3  (via drill 0.35)
  Top 0.152: BUFFER3.16 93.98,45.41 94.44,45.41 99.01,40.84 CABLE1.3 99.16,40.84 99.16,35.66 CABLE2.3 99.16,35.51 99.16,30.48 | CABLE5.3 99.16,20.42 99.16,25.3 CABLE4.3 99.16,25.45 99.16,30.48 | 99.16,30.48 CABLE3.3 | CABLE9.3 57.25,36.12 62.13,36.12 CABLE10.3 | CABLE8.3 73.71,5.18 73.71,10.06 CABLE7.3 73.71,10.21 73.71,15.24 CABLE6.3 73.56,15.24 71.73,17.07 69.14,17.07 68.83,17.37 v67.92,17.37
  Bottom 0.152: v67.92,17.37 65.94,19.36 61.52,19.36 60.45,20.42 60.45,21.95 59.84,22.55 59.84,33.22 57.25,35.81 57.25,36.12 CABLE9.3 | CABLE5.3 99.01,20.27 99.01,19.96 95.35,16.31 95.35,14.33 93.07,12.04 88.49,12.04 87.43,10.97 87.43,8.99 86.51,8.08 75.69,8.08 73.71,10.06 CABLE7.3
SERIAL_PIN4  (via drill 0.35)
  Top 0.152: CABLE8.4 76.3,5.18 76.3,10.06 CABLE7.4 76.3,10.21 76.3,15.24 CABLE6.4 | 96.57,30.48 96.57,35.51 CABLE2.4 96.57,35.66 96.57,40.84 CABLE1.4 96.42,40.84 91.85,45.41 91.54,45.41 BUFFER3.15 | 96.57,30.48 96.57,25.45 CABLE4.4 96.57,25.3 96.57,20.42 CABLE5.4 96.42,20.27 94.13,17.98 v89.41,17.98 | 96.57,30.48 CABLE3.4 | CABLE9.4 57.25,33.68 62.13,33.68 CABLE10.4 62.28,33.53 67.92,33.53 68.38,33.07 v70.51,33.07
  Bottom 0.152: v89.41,17.98 87.88,16.46 87.88,14.48 86.82,13.41 78.13,13.41 76.3,15.24 CABLE6.4 | v70.51,33.07 81.03,33.07 82.7,34.75 82.7,36.73 84.99,39.01 86.82,39.01 87.88,40.08 87.88,42.06 91.39,45.57 BUFFER3.15
SERIAL_PIN5
  Top 0.152: BUFFER3.14 88.95,45.41 89.41,45.41 CABLE1.5 CABLE2.5 CABLE3.5 CABLE4.5 CABLE5.5 | CABLE10.5 62.13,31.09 57.25,31.09 CABLE9.5 57.1,30.94 55.27,29.11 55.27,23.01 56.34,21.95 58.62,21.95 61.21,19.36 67.31,19.36 69.29,17.37 76.61,17.37 CABLE6.5 CABLE7.5 CABLE8.5
  Bottom 0.152: CABLE5.5 93.98,17.53 92.76,16.31 92.76,13.87 91.24,12.34 86.36,12.34 84.84,10.82 84.84,8.99 84.23,8.38 80.42,8.38 78.74,10.06 CABLE7.5
SERIAL_PIN6
  Top 0.152: BUFFER3.13 86.36,45.41 86.82,45.41 91.39,40.84 CABLE1.6 91.54,40.84 91.54,35.66 CABLE2.6 91.54,35.51 91.54,30.48 | CABLE5.6 91.54,20.42 91.54,25.3 CABLE4.6 91.54,25.45 91.54,30.48 | 91.54,30.48 CABLE3.6 | CABLE9.6 57.25,28.5 62.13,28.5 CABLE10.6 | CABLE8.6 81.33,5.18 81.33,10.06 CABLE7.6 81.33,10.21 81.33,15.24 CABLE6.6
  Bottom 0.152: CABLE10.6 62.13,28.5 62.13,28.19 60.45,26.52 60.45,25.45 61.37,24.54 63.35,24.54 67.46,20.42 67.46,19.2 69.6,17.07 79.35,17.07 81.18,15.24 CABLE6.6 | CABLE7.6 83.77,12.65 91.08,12.65 92.46,14.02 92.46,16.46 91.54,17.37 91.54,20.27 CABLE5.6
SERIAL_PIN7
  Top 0.152: BUFFER3.12 83.92,45.41 84.23,45.41 88.8,40.84 CABLE1.7 88.95,40.84 88.95,35.66 CABLE2.7 88.95,35.51 88.95,30.48 | CABLE5.7 88.95,20.42 88.95,25.3 CABLE4.7 88.95,25.45 88.95,30.48 | 88.95,30.48 CABLE3.7 | CABLE9.7 57.25,26.06 62.13,26.06 CABLE10.7 | CABLE8.7 83.92,5.18 83.92,10.06 CABLE7.7 83.92,10.21 83.92,15.24 CABLE6.7
  Bottom 0.152: 83.77,15.24 81.94,17.07 79.81,17.07 77.67,19.2 77.67,21.03 75.84,22.86 68.83,22.86 65.79,25.91 62.28,25.91 CABLE10.7 | 83.77,15.24 88.8,20.27 CABLE5.7 | 83.77,15.24 CABLE6.7
SERIAL_PIN8
  Top 0.152: BUFFER3.11 81.33,45.41 81.79,45.41 CABLE1.8 CABLE2.8 CABLE3.8 CABLE4.8 86.36,22.86 | CABLE9.8 57.25,23.47 62.13,23.47 CABLE10.8 62.28,23.32 66.55,23.32 67.01,22.86 86.36,22.86 | CABLE8.8 CABLE7.8 CABLE6.8 CABLE5.8 86.36,22.86
SERIAL_PIN9  (via drill 0.35)
  Top 0.152: BUFFER2.18 66.09,45.41 66.7,45.41 68.83,43.28 81.33,43.28 83.77,40.84 CABLE1.9 83.92,40.84 83.92,35.66 CABLE2.9 83.92,35.51 83.92,30.48 | CABLE8.9 88.95,5.18 88.95,10.06 CABLE7.9 88.95,10.21 88.95,15.24 CABLE6.9 | v59.84,21.64 61.52,21.64 62.13,21.03 CABLE10.9 62.28,21.03 67.01,21.03 68.53,22.55 81.64,22.55 83.77,20.42 CABLE5.9 | 83.92,30.48 83.92,25.45 CABLE4.9 | 83.92,30.48 CABLE3.9
  Bottom 0.152: v59.84,21.64 59.23,21.03 57.25,21.03 CABLE9.9 | 83.92,22.1 83.92,25.3 CABLE4.9 | 83.92,22.1 83.92,20.42 CABLE5.9 | 83.92,22.1 89.41,22.1 90.02,21.49 90.02,17.68 88.95,16.61 88.95,15.24 CABLE6.9
SERIAL_PIN10
  Top 0.152: 81.33,30.48 81.33,35.51 CABLE2.10 81.33,35.66 81.33,40.84 CABLE1.10 81.18,40.84 79.05,42.98 67.16,42.98 64.72,45.41 63.5,45.41 BUFFER2.17 | 81.33,30.48 81.33,25.45 CABLE4.10 | 81.33,30.48 CABLE3.10 | CABLE9.10 57.25,18.44 62.13,18.44 CABLE10.10 | CABLE8.10 91.54,5.18 91.54,10.06 CABLE7.10 91.54,10.21 91.54,15.24 CABLE6.10
  Bottom 0.152: CABLE5.10 81.33,20.42 81.33,25.3 CABLE4.10 81.33,25.45 81.64,25.45 83.46,27.28 86.67,27.28 87.88,26.06 87.88,24.08 90.32,21.64 90.32,16.31 91.39,15.24 | 91.39,15.24 89.26,13.11 68.53,13.11 63.35,18.29 62.28,18.29 CABLE10.10 | 91.39,15.24 CABLE6.10
SIG1
  Top 0.152: CABLE1.11 76.91,42.67 64.87,42.67 62.13,45.41 61.06,45.41 BUFFER2.16
SIG2
  Top 0.152: BUFFER2.15 58.47,45.41 59.54,45.41 62.13,42.82 64.26,42.82 68.83,38.25 76.15,38.25 78.74,35.66 CABLE2.11
SIG3
  Top 0.152: CABLE3.11 77.67,31.55 77.67,36.27 76,37.95 68.68,37.95 64.11,42.52 59.99,42.52 57.1,45.41 55.88,45.41 BUFFER2.14
SIG4
  Top 0.152: BUFFER2.13 53.44,45.41 54.51,45.41 57.71,42.21 63.96,42.21 68.53,37.64 73.86,37.64 75.08,36.42 75.08,29.11 78.74,25.45 CABLE4.11
SIG5
  Bottom 0.152: BUFFER2.12 50.85,45.41 51.92,45.41 55.12,42.21 58.93,42.21 61.37,39.78 63.35,39.78 67.46,35.66 67.46,29.41 69.6,27.28 74.02,27.28 75.08,26.21 75.08,24.08 78.74,20.42 CABLE5.11
SIG6
  Bottom 0.152: CABLE6.11 95.05,16.31 95.05,21.49 92.91,23.62 92.91,45.57 90.63,47.85 51.61,47.85 49.33,45.57 48.26,45.57 BUFFER2.11
SIG7  (via drill 0.35)
  Top 0.152: v47.65,28.5 47.65,28.19 49.17,26.67 50.39,26.67 55.27,21.79 55.27,17.98 56.34,16.92 58.93,16.92 61.52,14.33 63.5,14.33 67.46,10.36 67.46,3.96 68.53,2.9 91.54,2.9 92.91,4.27 92.91,8.99 93.98,10.06 CABLE7.11
  Bottom 0.152: BUFFER1.18 33.02,42.52 35,40.54 35.61,40.54 v47.65,28.5
SIG8
  Bottom 0.152: BUFFER1.17 30.58,45.57 31.65,45.57 34.24,48.16 92.76,48.16 95.5,45.41 95.5,33.68 97.94,31.24 97.94,28.8 100.53,26.21 100.53,23.62 102.67,21.49 102.67,18.59 100.08,16 100.08,13.41 97.64,10.97 97.64,8.84 93.98,5.18 CABLE8.11
SIG9
  Bottom 0.152: BUFFER1.16 27.99,45.41 27.99,44.96 35.61,37.34 35.76,37.34 49.33,23.77 49.33,21.18 51,19.51 53.44,19.51 57.1,15.85 CABLE9.11
SIG10
  Bottom 0.152: BUFFER1.15 25.4,37.49 30.89,32 30.89,26.82 37.44,20.27 49.78,20.27 50.85,19.2 51.46,19.2 55.88,14.78 61.21,14.78 62.13,15.7 CABLE10.11
VCC  (via drill 0.35)  (1 unrouted)
  Top 0.152: C12.1 43.08,46.94 39.57,46.94 38.2,45.57 BUFFER1.20 | DECADE1.16 21.74,41.45 21.74,40.69 20.68,39.62 20.68,38.4 21.74,37.34 24.49,37.34 26.62,35.2 29.06,35.2 35.31,41.45 DECADE2.16 | C10.1 12.9,5.18 11.53,5.18 5.28,11.43 C6.1 4.98,11.43 3.3,13.11 3.3,43.59 4.98,45.26 4.98,45.72 JP1.1 | CABLE5.12 76.3,20.42 76.61,20.42 78.28,22.1 79.65,22.1 v79.81,21.95 79.81,16.92 80.26,16.46 80.26,7.31 v80.42,7.16 | C11.1 76.15,46.94 72.49,46.94 71.12,45.57 BUFFER2.20 | CABLE3.12 76.3,30.48 76.3,35.51 CABLE2.12 | v47.8,18.9 45.21,21.49 | CABLE10.12 62.13,13.26 57.25,13.26 CABLE9.12 | CABLE8.12 96.57,5.18 96.57,10.06 CABLE7.12 96.57,10.21 96.57,15.24 CABLE6.12
  Bottom 0.152: BUFFER1.20 38.05,45.57 36.98,45.57 35.92,46.63 35.15,46.63 34.54,46.02 34.54,42.37 35.31,41.6 DECADE2.16 | 23.11,5.18 19.3,5.18 18.54,5.94 13.82,5.94 13.06,5.18 C10.1 | 23.11,5.18 23.27,5.18 | 23.11,5.18 23.11,18.74 | 23.11,18.74 23.11,26.37 22.2,27.28 22.05,27.28 20.98,28.35 20.98,39.47 21.74,40.23 21.74,41.45 DECADE1.16 | 76.3,25.45 v79.81,21.95 | 76.3,40.84 76.3,35.66 CABLE2.12 | 76.3,40.84 76.3,46.94 C11.1 | 76.3,40.84 CABLE1.12 | 76.3,25.45 76.3,30.48 CABLE3.12 | 76.3,25.45 CABLE4.12 | v47.8,18.9 51.31,18.9 53.75,16.46 | 53.75,16.46 56.79,13.41 57.1,13.41 CABLE9.12 | 111.66,16 111.66,19.2 110.9,19.96 110.9,34.14 111.66,34.9 C8.1 111.66,35.05 111.66,35.51 104.19,42.98 104.19,45.41 BUFFER3.20 | 111.66,16 111.66,15.39 104.65,8.38 100.08,8.38 96.88,5.18 96.57,5.18 CABLE8.12 | 111.66,16 C1.1 | 80.42,7.47 93.83,7.47 CABLE7.12 | 80.42,7.47 68.99,7.47 63.2,13.26 62.28,13.26 CABLE10.12 | 80.42,7.47 v80.42,7.16 | 23.11,18.74 30.12,18.74 33.93,14.94 48.11,14.94 49.33,13.72 49.33,13.56 49.94,12.95 50.55,12.95 51.76,14.17 51.76,14.48 53.75,16.46